# EAGLE schematic x9d_usb-c_mod (EAGLE 9.4.2)
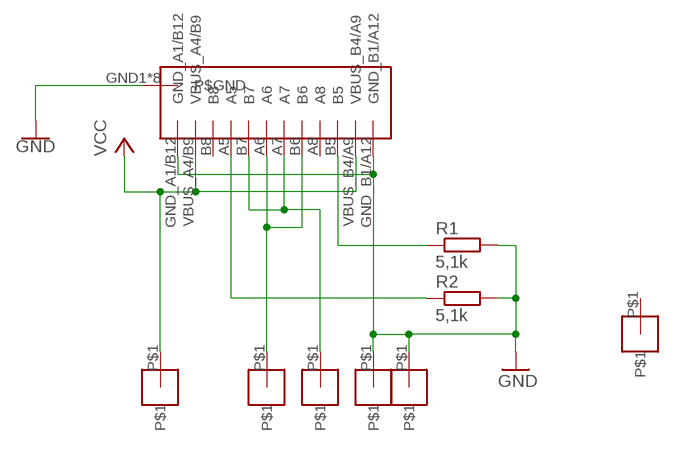
[diagram p0: schematic, sheet 1]

## Parts
GND1  MOTORPADPAD_1X2  [PAD_1X2]
MID1  MOTORPADPAD_1X2  [PAD_1X2]
MID2  MOTORPADPAD_1X2  [PAD_1X2]
MID3  MOTORPADPAD_1X2  [PAD_1X2]
MID4  MOTORPADPAD_1X2  [PAD_1X2]
MID6  MOTORPADPAD_1X2  [PAD_1X2]
R1  5,1k  R-EU_R0805  [R0805]
R2  5,1k  R-EU_R0805  [R0805]
U$1  USB-C_2.0SOFNG_MC-331D  [USB-C_MC-331D]

## Nets
GND: GND1.P$1 MID1.P$1 R1.2 R2.2 U$1.GND1(P$GND) U$1.GND2(P$GND) U$1.GND3(P$GND) U$1.GND4(P$GND) U$1.GND5(P$GND) U$1.GND6(P$GND) U$1.GND7(P$GND) U$1.GND8(P$GND) U$1.GND_A1/B12 U$1.GND_B1/A12
N$4: MID6.P$1 U$1.A7 U$1.B7
N$5: MID3.P$1 U$1.A6 U$1.B6
N$6: R1.1 U$1.B5
N$7: R2.1 U$1.A5
VCC: MID2.P$1 U$1.VBUS_A4/B9 U$1.VBUS_B4/A9
Unconnected: MID4.P$1 U$1.A8 U$1.B8

## Library data of the parts
GND1 MID1-MID4 MID6 = JS_LIB2:MOTORPAD
R1 R2 = rcl:R-EU_: RESISTOR, European symbol; SPICEPREFIX: R
U$1 = JS_LIB2:USB-C_2.0